# EAGLE design shield (EAGLE 7.6.0)
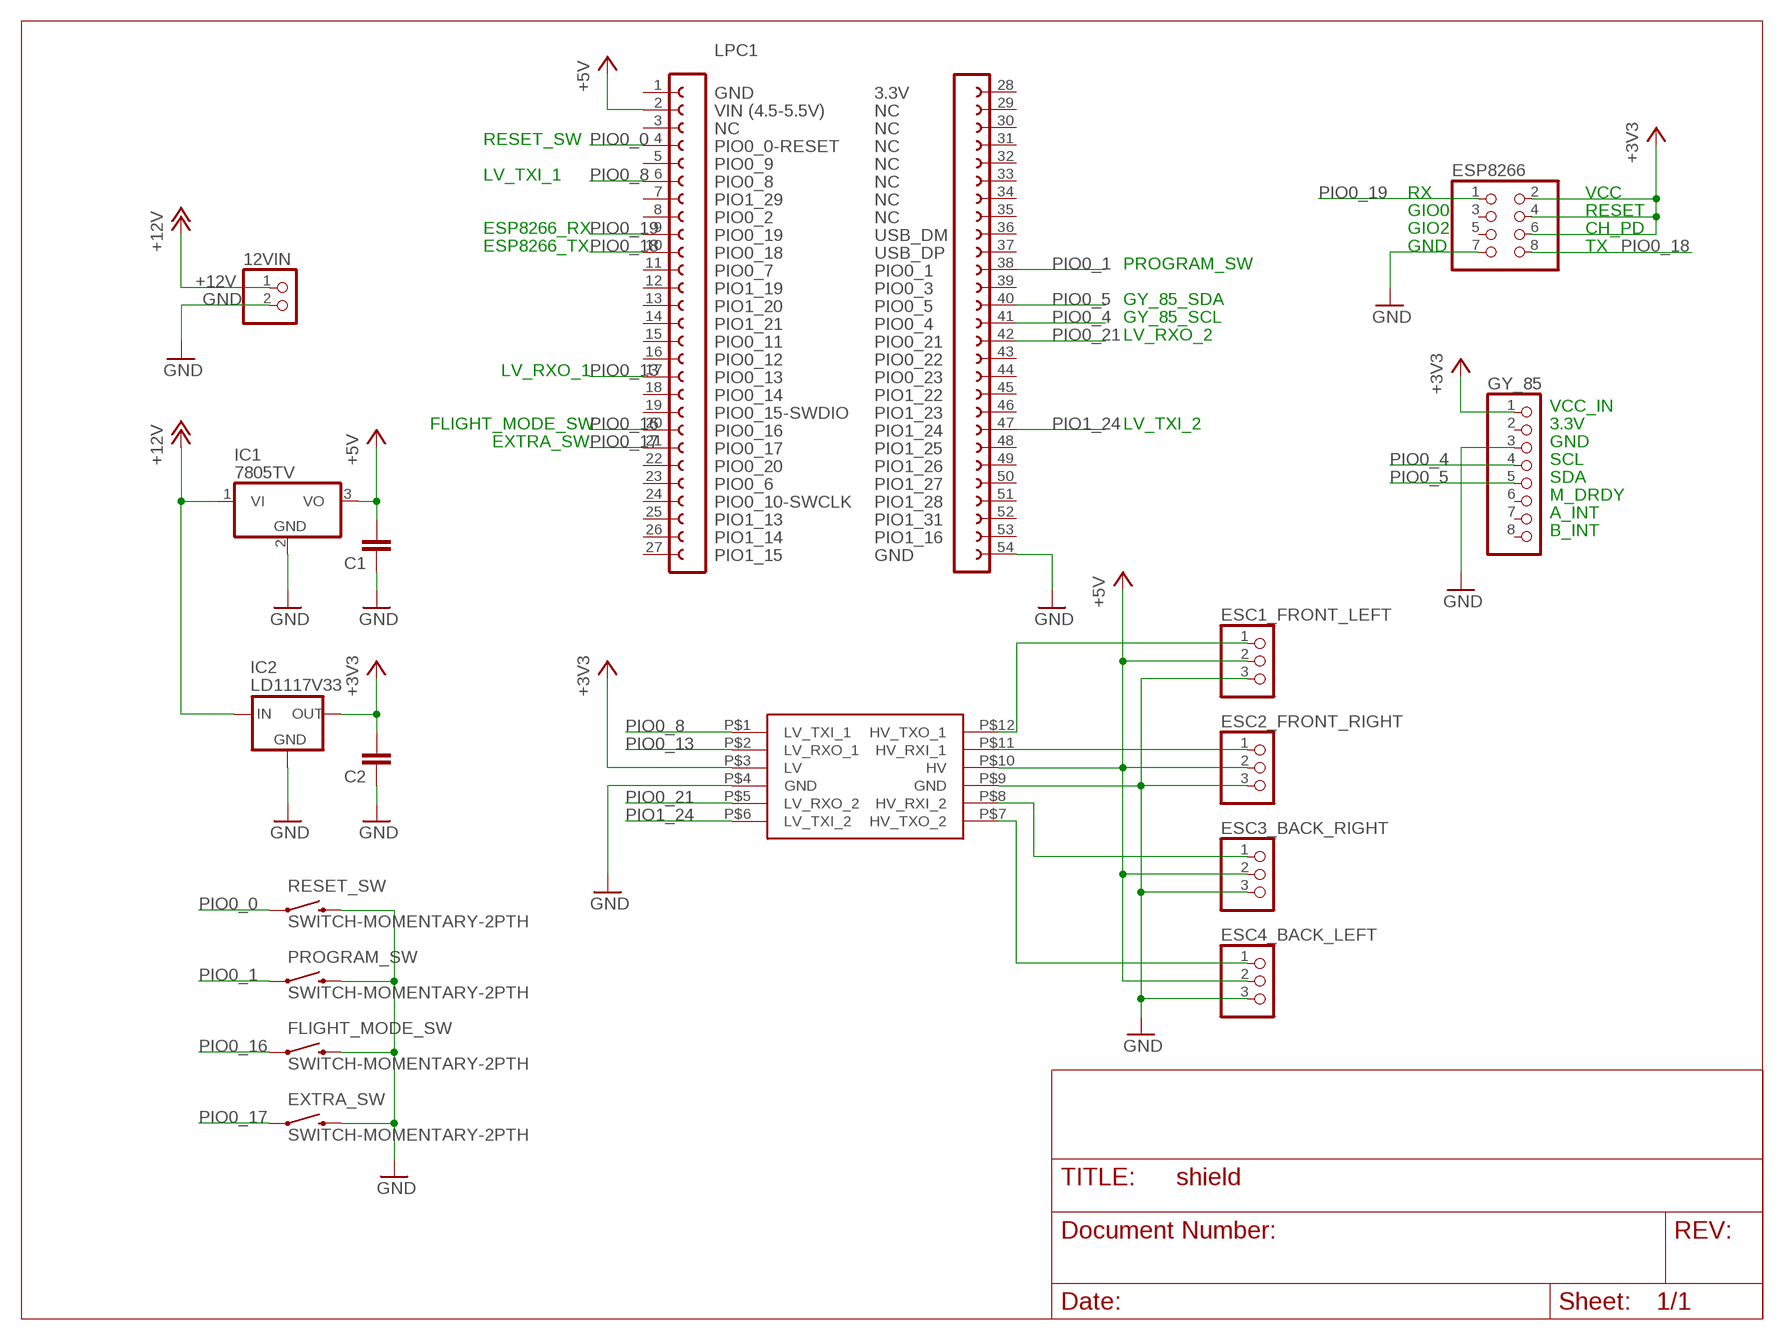
[diagram p0: schematic, sheet 1]

## Parts
12VIN  PINHD-1X2  [1X02]
C1  C-EU025-024X044  [C025-024X044]
C2  C-EU025-024X044  [C025-024X044]
ESC1_FRONT_LEFT  PINHD-1X3  [1X03]
ESC2_FRONT_RIGHT  PINHD-1X3  [1X03]
ESC3_BACK_RIGHT  PINHD-1X3  [1X03]
ESC4_BACK_LEFT  PINHD-1X3  [1X03]
ESP8266  PINHD-2X4  [2X04]
EXTRA_SW  SWITCH-MOMENTARY-2PTH  [TACTILE-PTH]
FLIGHT_MODE_SW  SWITCH-MOMENTARY-2PTH  [TACTILE-PTH]
GY_85  PINHD-1X8  [1X08]
IC1  7805TV  [TO220V]
IC2  LD1117V33  [LD1117V33]
LPC1  LPCXPRESSO_LPC11U14  [LPCXPRESSO_LPC11U14]
PROGRAM_SW  SWITCH-MOMENTARY-2PTH  [TACTILE-PTH]
RESET_SW  SWITCH-MOMENTARY-2PTH  [TACTILE-PTH]
U$1  LOGIC_LEVEL_CONVERTER  [LOGIC_LEVEL_CONVERTER]

## Nets
+3V3: C2.2 ESP8266.2 ESP8266.4 ESP8266.6 GY_85.1 IC2.OUT U$1.P$3(LV)
+5V: C1.2 ESC1_FRONT_LEFT.2 ESC2_FRONT_RIGHT.2 ESC3_BACK_RIGHT.2 ESC4_BACK_LEFT.2 IC1.3(VO) LPC1.2 U$1.P$10(HV)
+12V: 12VIN.1 IC1.1(VI) IC2.IN
GND: 12VIN.2 C1.1 C2.1 ESC1_FRONT_LEFT.3 ESC2_FRONT_RIGHT.3 ESC3_BACK_RIGHT.3 ESC4_BACK_LEFT.3 ESP8266.7 EXTRA_SW.3 FLIGHT_MODE_SW.3 GY_85.3 IC1.2(GND) IC2.GND LPC1.54 PROGRAM_SW.3 RESET_SW.3 U$1.P$4(GND) U$1.P$9(GND)
N$5: ESC4_BACK_LEFT.1 U$1.P$7(HV_TXO_2)
N$7: ESC3_BACK_RIGHT.1 U$1.P$8(HV_RXI_2)
N$8: ESC2_FRONT_RIGHT.1 U$1.P$11(HV_RXI_1)
N$9: ESC1_FRONT_LEFT.1 U$1.P$12(HV_TXO_1)
PIO0_0: LPC1.4 RESET_SW.1
PIO0_1: LPC1.38 PROGRAM_SW.1
PIO0_4: GY_85.4 LPC1.41
PIO0_5: GY_85.5 LPC1.40
PIO0_8: LPC1.6 U$1.P$1(LV_TXI_1)
PIO0_13: LPC1.17 U$1.P$2(LV_RXO_1)
PIO0_16: FLIGHT_MODE_SW.1 LPC1.20
PIO0_17: EXTRA_SW.1 LPC1.21
PIO0_18: ESP8266.8 LPC1.10
PIO0_19: ESP8266.1 LPC1.9
PIO0_21: LPC1.42 U$1.P$5(LV_RXO_2)
PIO1_24: LPC1.47 U$1.P$6(LV_TXI_2)
Unconnected: ESP8266.3 ESP8266.5 GY_85.2 GY_85.6 GY_85.7 GY_85.8 LPC1.1 LPC1.3 LPC1.5 LPC1.7 LPC1.8 LPC1.11 LPC1.12 LPC1.13 LPC1.14 LPC1.15 LPC1.16 LPC1.18 LPC1.19 LPC1.22 LPC1.23 LPC1.24 LPC1.25 LPC1.26 LPC1.27 LPC1.28 LPC1.29 LPC1.30 LPC1.31 LPC1.32 LPC1.33 LPC1.34 LPC1.35 LPC1.36 LPC1.37 LPC1.39 LPC1.43 LPC1.44 LPC1.45 LPC1.46 LPC1.48 LPC1.49 LPC1.50 LPC1.51 LPC1.52 LPC1.53

## Notes on the sheet
- RESET_SW
- LV_TXI_1
- RX | VCC
- GIO0 | RESET
- ESP8266_RX | GIO2 | CH_PD
- ESP8266_TX | GND | TX
- PROGRAM_SW
- GY_85_SDA
- GY_85_SCL
- LV_RXO_2
- LV_RXO_1
- VCC_IN
- FLIGHT_MODE_SW | LV_TXI_2 | 3.3V
- EXTRA_SW | GND
- SCL
- SDA
- M_DRDY
- A_INT
- B_INT

## Library data of the parts
12VIN = pinhead:PINHD-1X2: PIN HEADER
C1 C2 = rcl:C-EU: CAPACITOR, European symbol
ESC1_FRONT_LEFT ESC2_FRONT_RIGHT ESC3_BACK_RIGHT ESC4_BACK_LEFT = pinhead:PINHD-1X3: PIN HEADER
ESP8266 = pinhead:PINHD-2X4: PIN HEADER
EXTRA_SW FLIGHT_MODE_SW PROGRAM_SW RESET_SW = SparkFun-Electromechanical:SWITCH-MOMENTARY-2: Various NO switches- pushbuttons, reed, etc; PROD_ID: SWCH-08441
GY_85 = pinhead:PINHD-1X8: PIN HEADER
IC1 = linear:78*: Positive VOLTAGE REGULATOR Source: http://cache.national.com/ds/LM/LM78L05.pdf http://www.fairchildsemi.com/ds/LM/LM7805.pdf
IC2 = LD1117V33:LD1117V33
LPC1 = LPCXpresso_boards:LPCXPRESSO_LPC11U14
U$1 = SparkFun-Boards:LOGIC_LEVEL_CONVERTER: Logic Level Converter (3.3v - 5v) https://www.sparkfun.com/products/8745

## Board
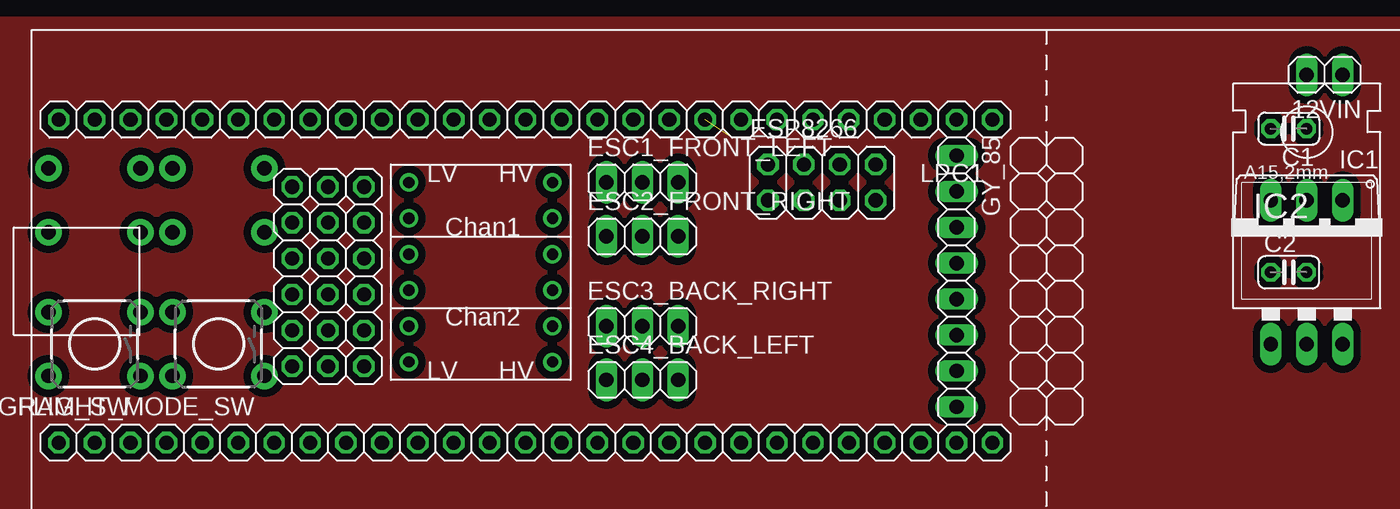
[diagram p1: board, top side]
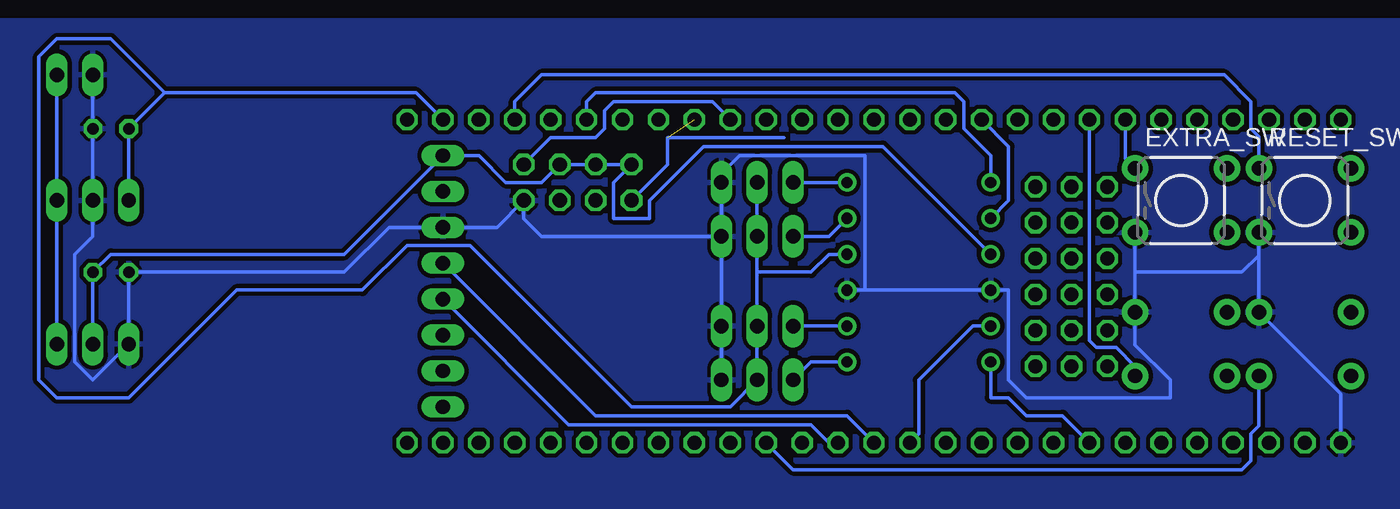
[diagram p2: board, bottom side, seen from below]

No outline drawn. Coordinates in mm, seen from the top.
Copper layers (1*16): Top 0.035mm / dielectric 1.5mm / Bottom 0.035mm
Design rules "default": minimum track width 10mil, minimum drill 24mil, track to track 8mil, track to pad 8mil, pad to pad 8mil, via to via 8mil, smd to smd 8mil, copper to edge 40mil, drill to drill 8mil, minimum pad ring 10mil, minimum via ring 8mil, stop-mask expansion 4mil, vias tented up to drill 0mil, thermal gap 10mil

### Footprints (pad centres in the part's own frame; a part is rotated, then mirrored left to right if it is on the bottom)
1X02 = drill 1.016 long: 1 -1.27,0; 2 1.27,0
C025-024X044 = drill 0.813 octagon: 1 -1.27,0; 2 1.27,0
1X03 = drill 1.016 long: 1 -2.54,0; 2 0,0; 3 2.54,0
2X04 = drill 1.016 octagon: 1 -3.81,-1.27; 2 -3.81,1.27; 3 -1.27,-1.27; 4 -1.27,1.27; 5 1.27,-1.27; 6 1.27,1.27; 7 3.81,-1.27; 8 3.81,1.27
TACTILE-PTH = drill 1.016 pad 1.88: 1 -3.251,2.261; 2 3.251,2.261; 3 -3.251,-2.261; 4 3.251,-2.261
1X08 = drill 1.016 long: 1 -8.89,0; 2 -6.35,0; 3 -3.81,0; 4 -1.27,0; 5 1.27,0; 6 3.81,0; 7 6.35,0; 8 8.89,0
TO220V = drill 1.016 long: 1 -2.54,-2.54; 2 0,-2.54; 3 2.54,-2.54
LD1117V33 = drill 1.016 long: GND -2.54,-8.89; IN 2.54,-8.89; OUT 0,-8.89
LPCXPRESSO_LPC11U14 = drill 1 octagon: 1 4.445,-10.795; 2 6.985,-10.795; 3 9.525,-10.795; 4 12.065,-10.795; 5 14.605,-10.795; 6 17.145,-10.795; 7 19.685,-10.795; 8 22.225,-10.795; 9 24.765,-10.795; 10 27.305,-10.795; 11 29.845,-10.795; 12 32.385,-10.795; 13 34.925,-10.795; 14 37.465,-10.795; 15 40.005,-10.795; 16 42.545,-10.795; 17 45.085,-10.795; 18 47.625,-10.795; 19 50.165,-10.795; 20 52.705,-10.795; 21 55.245,-10.795; 22 57.785,-10.795; 23 60.325,-10.795; 24 62.865,-10.795; 25 65.405,-10.795; 26 67.945,-10.795; 27 70.485,-10.795; 28 4.445,12.065; 29 6.985,12.065; 30 9.525,12.065; 31 12.065,12.065; 32 14.605,12.065; 33 17.145,12.065; 34 19.685,12.065; 35 22.225,12.065; 36 24.765,12.065; 37 27.305,12.065; 38 29.845,12.065; 39 32.385,12.065; 40 34.925,12.065; 41 37.465,12.065; 42 40.005,12.065; 43 42.545,12.065; 44 45.085,12.065; 45 47.625,12.065; 46 50.165,12.065; 47 52.705,12.065; 48 55.245,12.065; 49 57.785,12.065; 50 60.325,12.065; 51 62.865,12.065; 52 65.405,12.065; 53 67.945,12.065; 54 70.485,12.065; 55 48.895,-6.045; 56 51.435,-6.045; 57 53.975,-6.045; 58 48.895,-3.505; 59 51.435,-3.505; 60 53.975,-3.505; 61 48.895,-0.965; 62 51.435,-0.965; 63 53.975,-0.965; 64 48.895,1.575; 65 51.435,1.575; 66 53.975,1.575; 67 48.895,4.115; 68 51.435,4.115; 69 53.975,4.115; 70 48.895,6.655; 71 51.435,6.655; 72 53.975,6.655
LOGIC_LEVEL_CONVERTER = drill 0.8: P$1 1.27,13.97; P$2 1.27,11.43; P$3 1.27,8.89; P$4 1.27,6.35; P$5 1.27,3.81; P$6 1.27,1.27; P$7 11.43,1.27; P$8 11.43,3.81; P$9 11.43,6.35; P$10 11.43,8.89; P$11 11.43,11.43; P$12 11.43,13.97

### Placement (x,y rotation side)
12VIN  91.44,31.75 180 top
C1  88.9,27.94 180 top
C2  88.9,17.78 0 top
ESC1_FRONT_LEFT  43.18,24.13 0 top
ESC2_FRONT_RIGHT  43.18,20.32 0 top
ESC3_BACK_RIGHT  43.18,13.97 0 top
ESC4_BACK_LEFT  43.18,10.16 0 top
ESP8266  55.88,24.13 0 top
EXTRA_SW  13.21,22.86 0 bottom
FLIGHT_MODE_SW  13.21,12.7 180 top
GY_85  65.41,17.14 270 top
IC1  90.17,20.32 180 top
IC2  90.17,21.59 0 top
LPC1  72.39,17.78 180 top
PROGRAM_SW  4.45,12.7 180 top
RESET_SW  4.45,22.86 0 bottom
U$1  25.4,10.16 0 top

### Tracks (layer width: path | path; a pad name or v marks a point on that pad's centre or on a via)
+3V3
  Bottom 0.254: U$1.P$3 34.29,26.67 46.99,26.67 50.8,22.86 50.8,21.59 53.34,21.59 53.34,24.13 ESP8266.2 ESP8266.4 ESP8266.6 58.42,24.13 60.96,24.13 62.87,26.04 GY_85.1 72.39,19.05 88.9,19.05 C2.2 IC2.OUT
+5V
  Bottom 0.254: IC1.3 C1.2 85.09,30.48 | LPC1.2 67.31,30.48 85.09,30.48 | 85.09,30.48 88.9,34.29 92.71,34.29 93.98,33.02 93.98,10.16 92.71,8.89 87.63,8.89 80.01,16.51 71.12,16.51 67.94,19.68 63.5,19.68 52.07,8.26 45.09,8.26 ESC4_BACK_LEFT.2 ESC3_BACK_RIGHT.2 43.18,17.78 | 43.18,17.78 ESC2_FRONT_RIGHT.2 ESC1_FRONT_LEFT.2 | U$1.P$10 38.1,19.05 39.37,17.78 43.18,17.78
+12V
  Bottom 0.254: 12VIN.1 IC1.1 IC2.IN
_OUTLINES_
  pour Top (isolate 0.533, rank 6): -5.37,-0.15 140.44,-0.15 140.44,35.71 -5.37,35.71
GND
  Bottom 0.254: 12VIN.2 C1.1 IC1.2 90.17,20.32 91.44,19.05 91.44,11.43 90.17,10.16 IC2.GND C2.1 72.39,17.78 69.22,20.95 GY_85.3 61.59,20.95 ESP8266.7 59.69,21.59 58.42,20.32 ESC2_FRONT_RIGHT.3 | LPC1.54 1.91,9.17 PROGRAM_SW.3 7.7,18.97 | RESET_SW.3 7.7,18.97 | 7.7,18.97 8.89,17.78 16.46,17.78 | U$1.P$9 35.56,16.51 | 35.56,16.51 U$1.P$4 25.4,16.51 25.4,10.16 24.13,8.89 13.97,8.89 13.97,10.16 16.46,12.65 FLIGHT_MODE_SW.3 16.46,17.78 | ESC4_BACK_LEFT.3 ESC3_BACK_RIGHT.3 ESC2_FRONT_RIGHT.3 | ESC2_FRONT_RIGHT.3 ESC1_FRONT_LEFT.3 45.72,24.77 44.45,26.04 35.56,26.04 35.56,16.51 | EXTRA_SW.3 16.46,17.78
  pour Bottom (isolate 0.305): -3.81,35.56 -3.81,0 143.51,0 143.51,35.56
N$5
  Bottom 0.254: U$1.P$7 39.37,11.43 ESC4_BACK_LEFT.1
N$7
  Bottom 0.254: U$1.P$8 ESC3_BACK_RIGHT.1
N$8
  Bottom 0.254: ESC2_FRONT_RIGHT.1 38.1,20.32 U$1.P$11
N$9
  Bottom 0.254: U$1.P$12 ESC1_FRONT_LEFT.1
PIO0_0
  Bottom 0.254: RESET_SW.1 7.7,27.38 8.26,27.94 8.26,29.84 10.16,31.75 58.42,31.75 60.33,29.84 LPC1.4
PIO0_1
  Bottom 0.254: LPC1.38 40.64,3.81 8.89,3.81 8.26,4.45 8.26,6.35 7.7,6.91 PROGRAM_SW.1
PIO0_4
  Bottom 0.254: GY_85.4 54.61,7.62 36.83,7.62 LPC1.41
PIO0_5
  Bottom 0.254: LPC1.40 38.1,5.71 39.37,6.99 56.52,6.99 GY_85.5
PIO0_8
  Bottom 0.254: U$1.P$1 26.67,26.04 28.57,27.94 28.57,29.84 29.21,30.48 54.61,30.48 55.24,29.84 LPC1.6
PIO0_13
  Bottom 0.254: U$1.P$2 25.4,22.86 25.4,26.67 LPC1.17
PIO0_16
  Bottom 0.254: LPC1.20 19.68,12.95 19.18,12.45 17.78,12.45 16.46,11.12 FLIGHT_MODE_SW.1
PIO0_17
  Bottom 0.254: LPC1.21 17.14,25.81 EXTRA_SW.1
PIO0_18
  Bottom 0.254: ESP8266.8 57.78,27.3 54.61,27.3 53.98,27.94 53.98,29.21 53.34,29.84 46.35,29.84 LPC1.10
PIO0_19  (1 unrouted)
  Bottom 0.254: ESP8266.1 49.53,25.4 49.53,27.3 41.27,27.3
PIO0_21
  Bottom 0.254: U$1.P$5 27.94,13.97 31.75,10.16 31.75,6.35 LPC1.42
PIO1_24
  Bottom 0.254: U$1.P$6 26.67,8.89 25.4,8.89 24.13,7.62 21.59,7.62 LPC1.47